# EAGLE schematic Motor Driver 6 Element_Feb2012 (EAGLE 6.0)

## Sheet 1 of 2
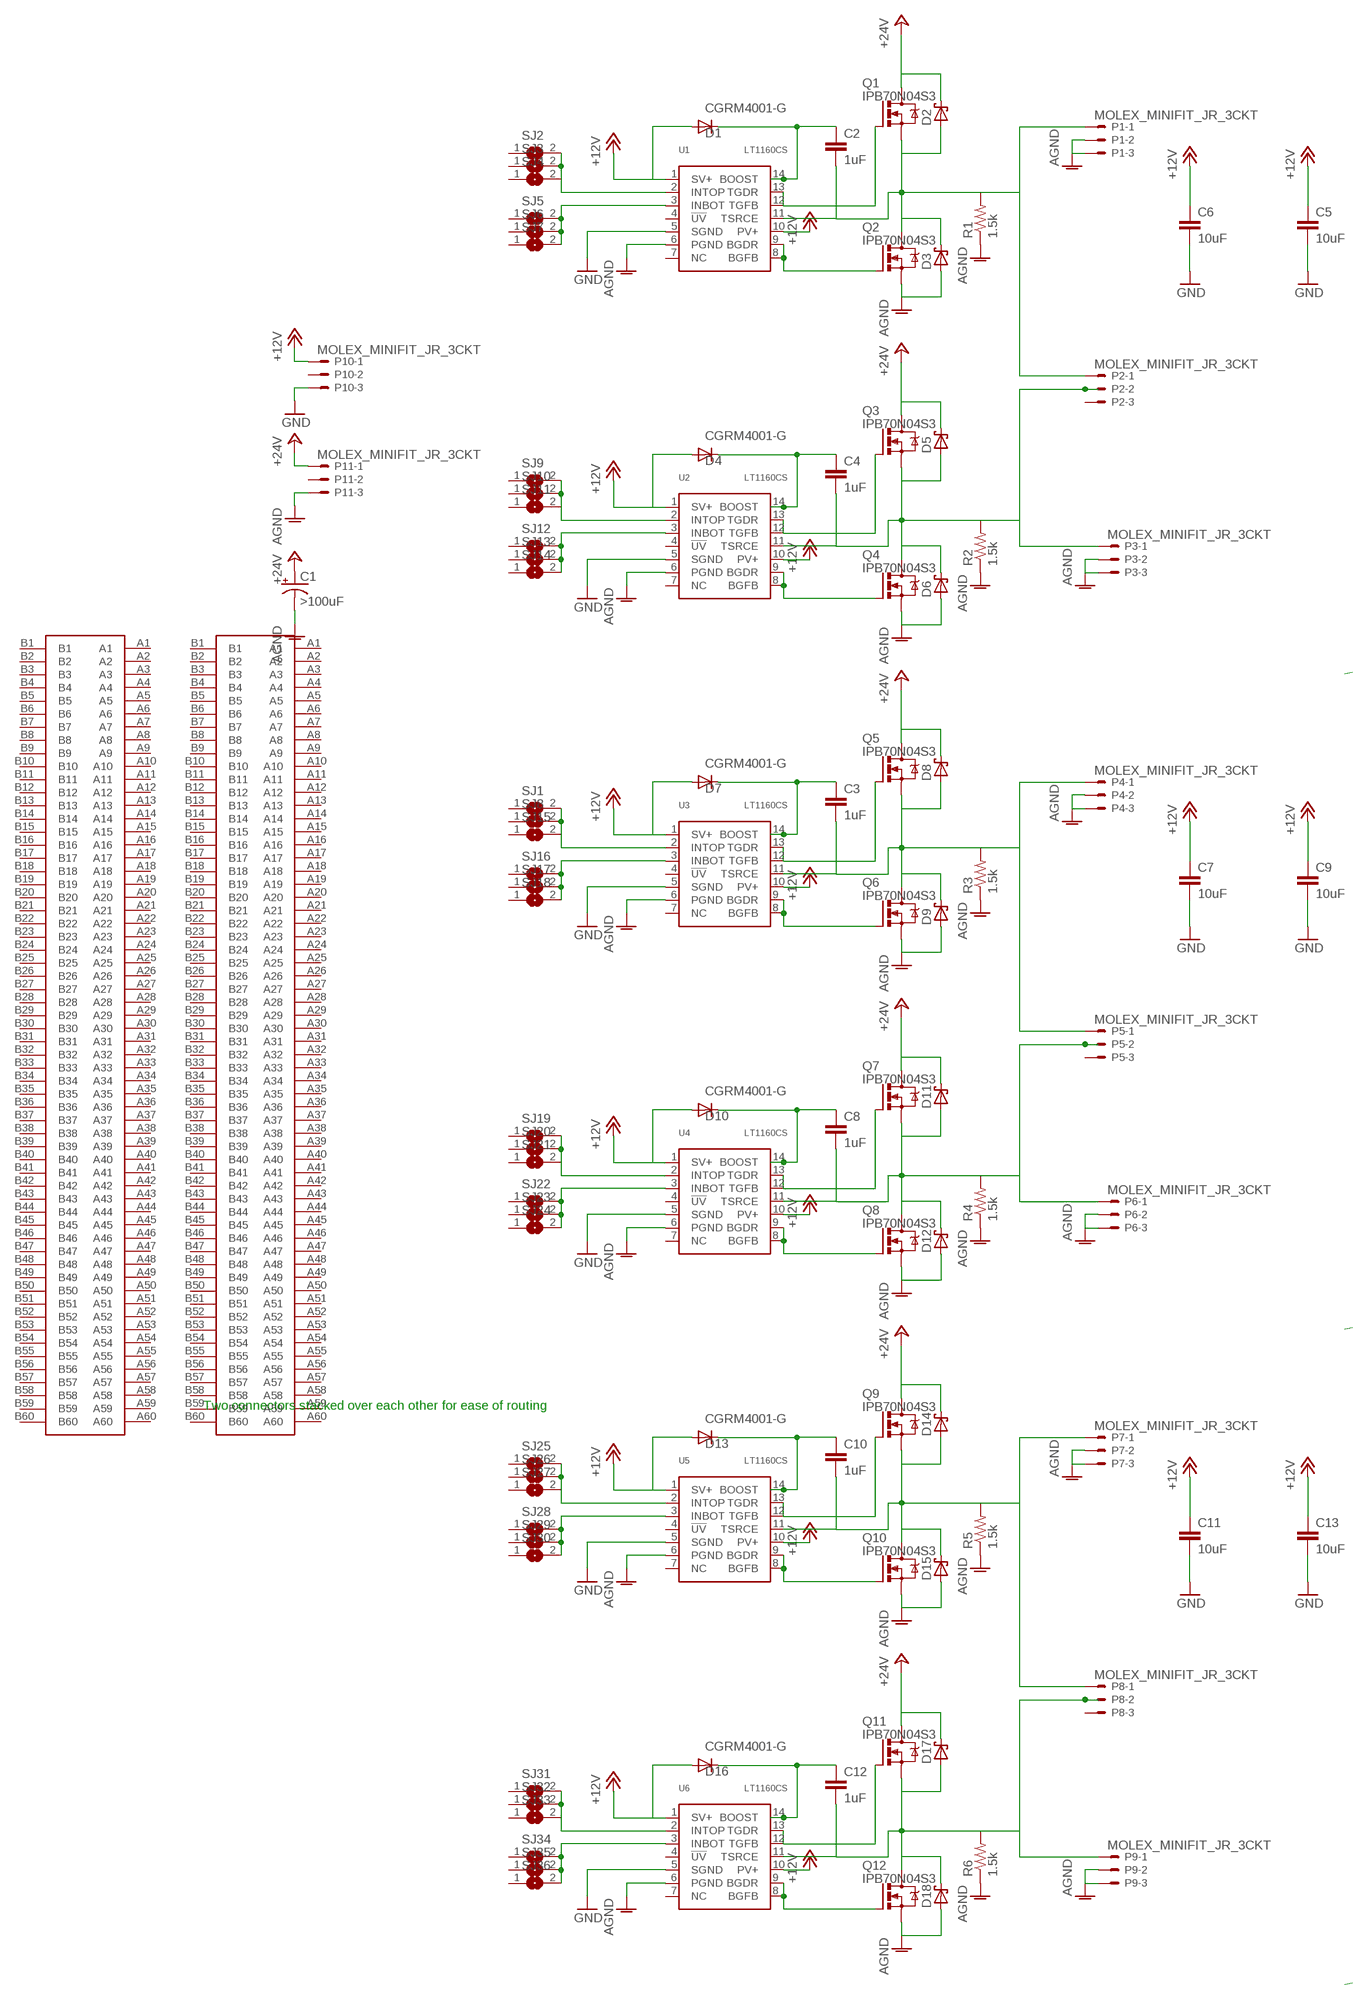
[diagram p0: schematic, sheet 1]

### Parts
C1  >100uF  CPOL-USE7.5-16  [E7,5-16]
C2  1uF  C-EUC1206  [C1206]
C3  1uF  C-EUC1206  [C1206]
C4  1uF  C-EUC1206  [C1206]
C5  10uF  C-EUC1206  [C1206@1]
C6  10uF  C-EUC1206  [C1206@1]
C7  10uF  C-EUC1206  [C1206@1]
C8  1uF  C-EUC1206  [C1206]
C9  10uF  C-EUC1206  [C1206@1]
C10  1uF  C-EUC1206  [C1206]
C11  10uF  C-EUC1206  [C1206@1]
C12  1uF  C-EUC1206  [C1206]
C13  10uF  C-EUC1206  [C1206@1]
D1  CGRM4001-G  [SOD-123_MINI-SMA]
D2  SCHOTTKY-DIODESMD  [SMB]
D3  SCHOTTKY-DIODESMD  [SMB]
D4  CGRM4001-G  [SOD-123_MINI-SMA]
D5  SCHOTTKY-DIODESMD  [SMB]
D6  SCHOTTKY-DIODESMD  [SMB]
D7  CGRM4001-G  [SOD-123_MINI-SMA]
D8  SCHOTTKY-DIODESMD  [SMB]
D9  SCHOTTKY-DIODESMD  [SMB]
D10  CGRM4001-G  [SOD-123_MINI-SMA]
D11  SCHOTTKY-DIODESMD  [SMB]
D12  SCHOTTKY-DIODESMD  [SMB]
D13  CGRM4001-G  [SOD-123_MINI-SMA]
D14  SCHOTTKY-DIODESMD  [SMB]
D15  SCHOTTKY-DIODESMD  [SMB]
D16  CGRM4001-G  [SOD-123_MINI-SMA]
D17  SCHOTTKY-DIODESMD  [SMB]
D18  SCHOTTKY-DIODESMD  [SMB]
P1  MOLEX_MINIFIT_JR_3CKT  [3CKT_MINIFIT_JR]
P2  MOLEX_MINIFIT_JR_3CKT  [3CKT_MINIFIT_JR]
P3  MOLEX_MINIFIT_JR_3CKT  [3CKT_MINIFIT_JR]
P4  MOLEX_MINIFIT_JR_3CKT  [3CKT_MINIFIT_JR]
P5  MOLEX_MINIFIT_JR_3CKT  [3CKT_MINIFIT_JR]
P6  MOLEX_MINIFIT_JR_3CKT  [3CKT_MINIFIT_JR]
P7  MOLEX_MINIFIT_JR_3CKT  [3CKT_MINIFIT_JR]
P8  MOLEX_MINIFIT_JR_3CKT  [3CKT_MINIFIT_JR]
P9  MOLEX_MINIFIT_JR_3CKT  [3CKT_MINIFIT_JR]
P10  MOLEX_MINIFIT_JR_3CKT  [3CKT_MINIFIT_JR]
P11  MOLEX_MINIFIT_JR_3CKT  [3CKT_MINIFIT_JR]
Q1  IPB70N04S3  [D-PAK_TO252AA]
Q2  IPB70N04S3  [D-PAK_TO252AA]
Q3  IPB70N04S3  [D-PAK_TO252AA]
Q4  IPB70N04S3  [D-PAK_TO252AA]
Q5  IPB70N04S3  [D-PAK_TO252AA]
Q6  IPB70N04S3  [D-PAK_TO252AA]
Q7  IPB70N04S3  [D-PAK_TO252AA]
Q8  IPB70N04S3  [D-PAK_TO252AA]
Q9  IPB70N04S3  [D-PAK_TO252AA]
Q10  IPB70N04S3  [D-PAK_TO252AA]
Q11  IPB70N04S3  [D-PAK_TO252AA]
Q12  IPB70N04S3  [D-PAK_TO252AA]
R1  1.5k  R-US_R2010  [R2010]
R2  1.5k  R-US_R2010  [R2010]
R3  1.5k  R-US_R2010  [R2010]
R4  1.5k  R-US_R2010  [R2010]
R5  1.5k  R-US_R2010  [R2010]
R6  1.5k  R-US_R2010  [R2010]
SJ1  SJ  [SJ]
SJ2  SJ  [SJ]
SJ3  SJ  [SJ]
SJ4  SJ  [SJ]
SJ5  SJ  [SJ]
SJ6  SJ  [SJ]
SJ7  SJ  [SJ]
SJ8  SJ  [SJ]
SJ9  SJ  [SJ]
SJ10  SJ  [SJ]
SJ11  SJ  [SJ]
SJ12  SJ  [SJ]
SJ13  SJ  [SJ]
SJ14  SJ  [SJ]
SJ15  SJ  [SJ]
SJ16  SJ  [SJ]
SJ17  SJ  [SJ]
SJ18  SJ  [SJ]
SJ19  SJ  [SJ]
SJ20  SJ  [SJ]
SJ21  SJ  [SJ]
SJ22  SJ  [SJ]
SJ23  SJ  [SJ]
SJ24  SJ  [SJ]
SJ25  SJ  [SJ]
SJ26  SJ  [SJ]
SJ27  SJ  [SJ]
SJ28  SJ  [SJ]
SJ29  SJ  [SJ]
SJ30  SJ  [SJ]
SJ31  SJ  [SJ]
SJ32  SJ  [SJ]
SJ33  SJ  [SJ]
SJ34  SJ  [SJ]
SJ35  SJ  [SJ]
SJ36  SJ  [SJ]
U1  LT1160CS  [SOIC14]
U2  LT1160CS  [SOIC14]
U3  LT1160CS  [SOIC14]
U4  LT1160CS  [SOIC14]
U5  LT1160CS  [SOIC14]
U6  LT1160CS  [SOIC14]
U$1  MAIN-STACK-CONN-WIDEPITCH  [STACK-CONN-WIDEPITCH]
U$2  MAIN-STACK-CONN-WIDEPITCH  [STACK-CONN-WIDEPITCH]

### Nets
+12V: C5.1 C6.1 C7.1 C9.1 C11.1 C13.1 D1.A D4.A D7.A D10.A D13.A D16.A P10.1 U1.1(SV+) U1.10(PV+) U2.1(SV+) U2.10(PV+) U3.1(SV+) U3.10(PV+) U4.1(SV+) U4.10(PV+) U5.1(SV+) U5.10(PV+) U6.1(SV+) U6.10(PV+)
+24V: C1.+ D2.C D5.C D8.C D11.C D14.C D17.C P11.1 Q1.4(D) Q3.4(D) Q5.4(D) Q7.4(D) Q9.4(D) Q11.4(D)
AGND: C1.- D3.A D6.A D9.A D12.A D15.A D18.A P1.3 P3.3 P4.3 P6.3 P7.3 P9.3 P11.3 Q2.3(S) Q4.3(S) Q6.3(S) Q8.3(S) Q10.3(S) Q12.3(S) R1.1 R2.1 R3.1 R4.1 R5.1 R6.1 U1.6(PGND) U2.6(PGND) U3.6(PGND) U4.6(PGND) U5.6(PGND) U6.6(PGND)
GND: C5.2 C6.2 C7.2 C9.2 C11.2 C13.2 P10.3 U1.5(SGND) U2.5(SGND) U3.5(SGND) U4.5(SGND) U5.5(SGND) U6.5(SGND)
N$1: C2.1 D1.C U1.14(BOOST)
N$2: SJ5.2 SJ6.2 SJ7.2 U1.3(INBOT)
N$3: C2.2 D2.A D3.C P1.1 P2.1 Q1.3(S) Q2.4(D) R1.2 U1.11(TSRCE)
N$4: SJ2.2 SJ3.2 SJ4.2 U1.2(INTOP)
N$5: C3.1 D7.C U3.14(BOOST)
N$6: Q2.1(G) U1.8(BGFB) U1.9(BGDR)
N$8: P1.2
N$9: Q1.1(G) U1.12(TGFB) U1.13(TGDR)
N$109: C3.2 D8.A D9.C P4.1 P5.1 Q5.3(S) Q6.4(D) R3.2 U3.11(TSRCE)
N$110: Q6.1(G) U3.8(BGFB) U3.9(BGDR)
N$111: C4.1 D4.C U2.14(BOOST)
N$112: C4.2 D5.A D6.C P2.2 P3.1 Q3.3(S) Q4.4(D) R2.2 U2.11(TSRCE)
N$113: Q4.1(G) U2.8(BGFB) U2.9(BGDR)
N$114: SJ9.2 SJ10.2 SJ11.2 U2.2(INTOP)
N$115: SJ12.2 SJ13.2 SJ14.2 U2.3(INBOT)
N$116: SJ1.2 SJ8.2 SJ15.2 U3.2(INTOP)
N$117: P3.2
N$118: Q3.1(G) U2.12(TGFB) U2.13(TGDR)
N$120: SJ16.2 SJ17.2 SJ18.2 U3.3(INBOT)
N$121: P4.2
N$122: Q5.1(G) U3.12(TGFB) U3.13(TGDR)
N$123: C8.1 D10.C U4.14(BOOST)
N$124: C8.2 D11.A D12.C P5.2 P6.1 Q7.3(S) Q8.4(D) R4.2 U4.11(TSRCE)
N$125: Q8.1(G) U4.8(BGFB) U4.9(BGDR)
N$126: SJ19.2 SJ20.2 SJ21.2 U4.2(INTOP)
N$127: SJ22.2 SJ23.2 SJ24.2 U4.3(INBOT)
N$128: P6.2
N$129: Q7.1(G) U4.12(TGFB) U4.13(TGDR)
N$132: C10.1 D13.C U5.14(BOOST)
N$133: C10.2 D14.A D15.C P7.1 P8.1 Q9.3(S) Q10.4(D) R5.2 U5.11(TSRCE)
N$134: Q10.1(G) U5.8(BGFB) U5.9(BGDR)
N$135: SJ25.2 SJ26.2 SJ27.2 U5.2(INTOP)
N$136: SJ28.2 SJ29.2 SJ30.2 U5.3(INBOT)
N$137: P7.2
N$138: Q9.1(G) U5.12(TGFB) U5.13(TGDR)
N$139: C12.1 D16.C U6.14(BOOST)
N$140: C12.2 D17.A D18.C P8.2 P9.1 Q11.3(S) Q12.4(D) R6.2 U6.11(TSRCE)
N$141: Q12.1(G) U6.8(BGFB) U6.9(BGDR)
N$142: SJ31.2 SJ32.2 SJ33.2 U6.2(INTOP)
N$143: SJ34.2 SJ35.2 SJ36.2 U6.3(INBOT)
N$144: P9.2
N$145: Q11.1(G) U6.12(TGFB) U6.13(TGDR)
Unconnected: P2.3 P5.3 P8.3 P10.2 P11.2 SJ1.1 SJ2.1 SJ3.1 SJ4.1 SJ5.1 SJ6.1 SJ7.1 SJ8.1 SJ9.1 SJ10.1 SJ11.1 SJ12.1 SJ13.1 SJ14.1 SJ15.1 SJ16.1 SJ17.1 SJ18.1 SJ19.1 SJ20.1 SJ21.1 SJ22.1 SJ23.1 SJ24.1 SJ25.1 SJ26.1 SJ27.1 SJ28.1 SJ29.1 SJ30.1 SJ31.1 SJ32.1 SJ33.1 SJ34.1 SJ35.1 SJ36.1 U1.4(!UV) U1.7(NC) U2.4(!UV) U2.7(NC) U3.4(!UV) U3.7(NC) U4.4(!UV) U4.7(NC) U5.4(!UV) U5.7(NC) U6.4(!UV) U6.7(NC) U$1.A1 U$1.A2 U$1.A3 U$1.A4 U$1.A5 U$1.A6 U$1.A7 U$1.A8 U$1.A9 U$1.A10 U$1.A11 U$1.A12 U$1.A13 U$1.A14 U$1.A15 U$1.A16 U$1.A17 U$1.A18 U$1.A19 U$1.A20 U$1.A21 U$1.A22 U$1.A23 U$1.A24 U$1.A25 U$1.A26 U$1.A27 U$1.A28 U$1.A29 U$1.A30 U$1.A31 U$1.A32 U$1.A33 U$1.A34 U$1.A35 U$1.A36 U$1.A37 U$1.A38 U$1.A39 U$1.A40 U$1.A41 U$1.A42 U$1.A43 U$1.A44 U$1.A45 U$1.A46 U$1.A47 U$1.A48 U$1.A49 U$1.A50 U$1.A51 U$1.A52 U$1.A53 U$1.A54 U$1.A55 U$1.A56 U$1.A57 U$1.A58 U$1.A59 U$1.A60 U$1.B1 U$1.B2 U$1.B3 U$1.B4 U$1.B5 U$1.B6 U$1.B7 U$1.B8 U$1.B9 U$1.B10 U$1.B11 U$1.B12 U$1.B13 U$1.B14 U$1.B15 U$1.B16 U$1.B17 U$1.B18 U$1.B19 U$1.B20 U$1.B21 U$1.B22 U$1.B23 U$1.B24 U$1.B25 U$1.B26 U$1.B27 U$1.B28 U$1.B29 U$1.B30 U$1.B31 U$1.B32 U$1.B33 U$1.B34 U$1.B35 U$1.B36 U$1.B37 U$1.B38 U$1.B39 U$1.B40 U$1.B41 U$1.B42 U$1.B43 U$1.B44 U$1.B45 U$1.B46 U$1.B47 U$1.B48 U$1.B49 U$1.B50 U$1.B51 U$1.B52 U$1.B53 U$1.B54 U$1.B55 U$1.B56 U$1.B57 U$1.B58 U$1.B59 U$1.B60 U$2.A1 U$2.A2 U$2.A3 U$2.A4 U$2.A5 U$2.A6 U$2.A7 U$2.A8 U$2.A9 U$2.A10 U$2.A11 U$2.A12 U$2.A13 U$2.A14 U$2.A15 U$2.A16 U$2.A17 U$2.A18 U$2.A19 U$2.A20 U$2.A21 U$2.A22 U$2.A23 U$2.A24 U$2.A25 U$2.A26 U$2.A27 U$2.A28 U$2.A29 U$2.A30 U$2.A31 U$2.A32 U$2.A33 U$2.A34 U$2.A35 U$2.A36 U$2.A37 U$2.A38 U$2.A39 U$2.A40 U$2.A41 U$2.A42 U$2.A43 U$2.A44 U$2.A45 U$2.A46 U$2.A47 U$2.A48 U$2.A49 U$2.A50 U$2.A51 U$2.A52 U$2.A53 U$2.A54 U$2.A55 U$2.A56 U$2.A57 U$2.A58 U$2.A59 U$2.A60 U$2.B1 U$2.B2 U$2.B3 U$2.B4 U$2.B5 U$2.B6 U$2.B7 U$2.B8 U$2.B9 U$2.B10 U$2.B11 U$2.B12 U$2.B13 U$2.B14 U$2.B15 U$2.B16 U$2.B17 U$2.B18 U$2.B19 U$2.B20 U$2.B21 U$2.B22 U$2.B23 U$2.B24 U$2.B25 U$2.B26 U$2.B27 U$2.B28 U$2.B29 U$2.B30 U$2.B31 U$2.B32 U$2.B33 U$2.B34 U$2.B35 U$2.B36 U$2.B37 U$2.B38 U$2.B39 U$2.B40 U$2.B41 U$2.B42 U$2.B43 U$2.B44 U$2.B45 U$2.B46 U$2.B47 U$2.B48 U$2.B49 U$2.B50 U$2.B51 U$2.B52 U$2.B53 U$2.B54 U$2.B55 U$2.B56 U$2.B57 U$2.B58 U$2.B59 U$2.B60

### Notes on the sheet
- Two connectors stacked over each other for ease of routing

## Sheet 2 of 2

## Library data of the parts
C1 = resistor:CPOL-US: POLARIZED CAPACITOR, American symbol
C2-C4 C8 C10 C12 = rcl:C-EU: CAPACITOR, European symbol
C5-C7 C9 C11 C13 = resistor:C-EU: CAPACITOR, European symbol
D1 D4 D7 D10 D13 D16 = diode:CGRM400*-G: Molded plasitc,JEDEC SOD-123/Mini SMA Source: Comchip CGRM4001-G.pdf
D2 D3 D5 D6 D8 D9 D11 D12 D14 D15 D17 D18 = diode:SCHOTTKY-DIODE: Schottky Diode
P1-P11 = Motor Driver Custom:MOLEX_MINIFIT_JR_3CKT
Q1-Q12 = Motor Driver Custom:IPB70N04S3
R1-R6 = rcl:R-US_: RESISTOR, American symbol
SJ1-SJ36 = jumper:SJ: SMD solder JUMPER
U1-U6 = Motor Driver Custom:LT1160CS
U$1 U$2 = interface (2):MAIN-STACK-CONN-WIDEPITCH